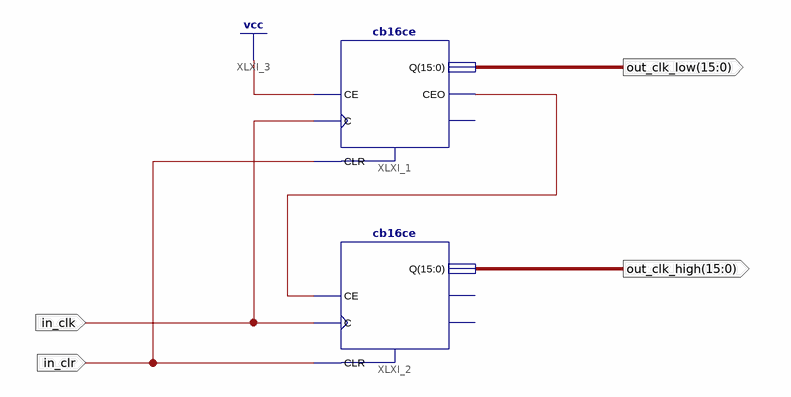
[diagram p0: schematic sheet 1]
// Xilinx ISE schematic cpu_freq_divider_base.sch (aspartan6) as structural Verilog: 2 symbols, 4 ports
module cpu_freq_divider_base (
  input  in_clr,
  input  in_clk,
  output [15:0] out_clk_high,
  output [15:0] out_clk_low
);

  wire XLXN_3;

  cb16ce XLXI_1 (.C(in_clk), .CE(1'b1), .CLR(in_clr), .CEO(XLXN_3), .Q(out_clk_low));  // open: TC
  cb16ce XLXI_2 (.C(in_clk), .CE(XLXN_3), .CLR(in_clr), .Q(out_clk_high));  // open: CEO, TC
endmodule
